# Altium schematic sheet TempRFIn.SchDoc
size A4; DrawnBy: LSR; Engineer: CW; SheetNumber: 1; SheetTotal: 1; PageSetup: Record=PageOptions|CenterHorizontal=True|CenterVertical=True|PrintScale=1.00|XCorrection=1.00|YCorrection=1.00|PrintKind=0|BorderSize=5000000|LeftOffset=0|BottomOffset=0|Orientation=2|PaperLength=1000|PaperWidth=1000|Scale=100|PaperSource=7|PrintQuality=-3|MediaType=1|DitherType=10|PrintScaleMode=1|PaperKind=A4|PaperIndex=9
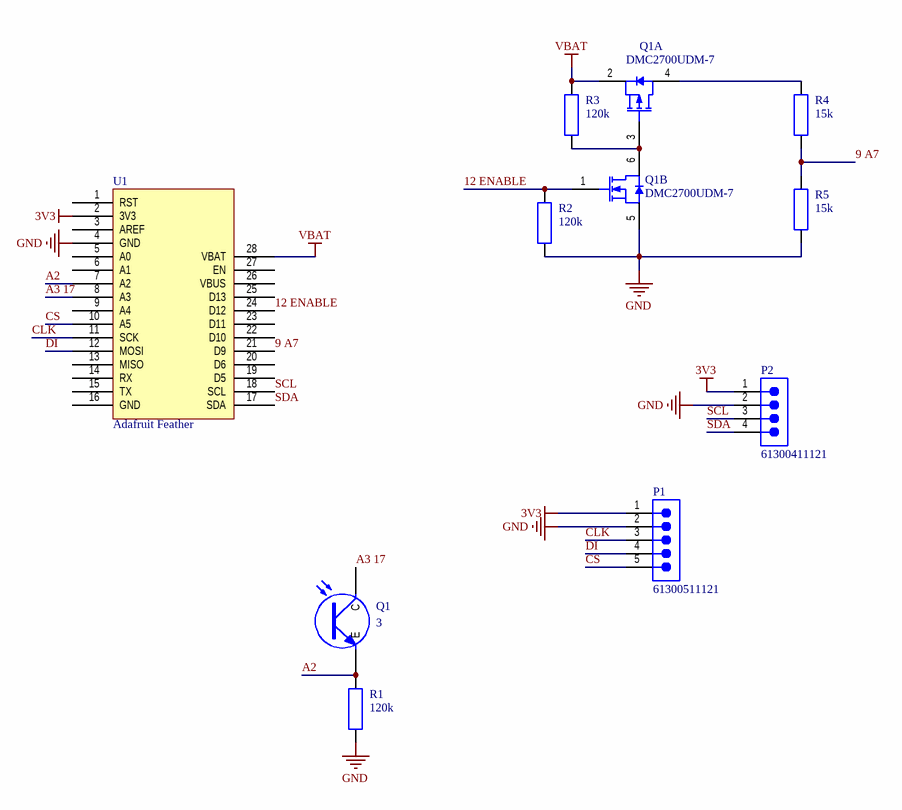
[diagram p0: TempRFIn.SchDoc]

## Parts
(Parts that share a designator on the sheet are numbered #1, #2 ... from top to bottom, then left to right.)
P1  61300511121  [61300511121]
P2  61300411121  [61300411121]
Q1#1  DMC2700UDM-7  [FAIR-SOT23-6_V]  (parts A,B of 2)
Q1#2  3  [WL-STCW_0805]
R1  120k  [0603]
R2  120k  [0603]
R3  120k  [0603]
R4  15k  [0603]
R5  15k  [0603]
U1  Adafruit Feather  [Adafruit Feather]

## Nets
3V3: P1.1 P2.1 U1.2(3V3)
GND: P1.2 P2.2 Q1#1.5(S) R1.1 R2.1 R5.1 U1.4(GND)
VBAT: Q1#1.2(S) R3.2 U1.28(VBAT)
9 A7: R4.1 R5.2 U1.21(D9)
12 ENABLE: Q1#1.1(G) R2.2 U1.24(D12)
A2: Q1#2.2(E) R1.2 U1.7(A2)
A3 17: Q1#2.1(C) U1.8(A3)
CLK: P1.3 U1.11(SCK)
CS: P1.5 U1.10(A5)
DI: P1.4 U1.12(MOSI)
SCL: P2.3 U1.18(SCL)
SDA: P2.4 U1.17(SDA)
NetQ1#1_3: Q1#1.3(G) Q1#1.6(D) R3.1
NetQ1#1_4: Q1#1.4(D) R4.2

Not connected (* = marked no-connect by the designer): U1 1(RST) 3(AREF) 5(A0) 6(A1) 9(A4) 13(MISO) 14(RX) 15(TX) 16(GND) 19(D5) 20(D6) 22(D10) 23(D11) 25(D13) 26(VBUS) 27(EN)

## Notes on the sheet
- CONFIDENTIAL
- Reference No:
- Date:
- File:
- Sheet
- Revision:
- Drawn by:
- of

## Library data of the parts
P1 = CMP-1502-01068-4: THT Vertical Pin Header WR-PHD, Pitch 2.54 mm, Single Row, 5 pins; Number of Contacts: 5; Connector Type: Male Pin; Operating Supply Voltage: 250V; Contact Resistance: 20mΩ; Gender: Male; Pitch: 2.54mm; Current Rating: 3A; Min Operating Temperature: -40°C; Contact Material: Gold; Color: Black; RoHS: Compliant; Number of Rows: 1; Lead Free: Lead Free; Height: 8.89mm; Contact Plating: Gold; Number of Pins: 5; Orientation: Vertical; Voltage Rating: 250V; Packaging: Bulk; Number of Positions: 5; Max Operating Temperature: 105°C; Termination: Solder; Lead Pitch: 2.54mm; Contact Mating Length: 5.9944mm; Mount: Through Hole
P2 = CMP-1502-01064-4: THT Vertical Pin Header WR-PHD, Pitch 2.54 mm, Single Row, 4 pins; Connector Type: Male Pin; Gender: Male; Current Rating: 3A; Number of Positions: 4; Operating Supply Voltage: 250V; Contact Resistance: 20mΩ; Pitch: 2.54mm; Max Operating Temperature: 105°C; Mount: Through Hole; Contact Material: Gold; Contact Plating: Gold; Number of Contacts: 4; Orientation: Vertical; Packaging: Bulk; Contact Mating Length: 5.9944mm; Voltage Rating: 250V; Number of Rows: 1; Height: 8.89mm; Lead Free: Lead Free; Lead Pitch: 2.54mm; Number of Pins: 4; Color: Black; Min Operating Temperature: -40°C; RoHS: Compliant; Termination: Solder
Q1#1 = CMP-2000-04939-1: Dual N & P-Channel 2.5 V Specified PowerTrench(TM) MOSFET, -55 to 150 degC, 6-Pin SOT-23, RoHS, Tape and Reel; Manufacturer: Fairchild; Typical Rise Time: 9@NChannel; Rad Hard: No; Maximum Drain Source Voltage: 20V; Typical Fall Time: 3@NChannel; Typical Turn-On Delay Time: 5@NChannel; Maximum Continuous Drain Current: 2.7@NChannel; Typical Turn-Off Delay Time: 12@NChannel; RDS-on: 80@4.5V@NChannel; Channel Mode: Enhancement; Maximum Gate Source Voltage: ±8V; Package Version: Rev. 5, 05/2015; Operating Temperature: -55to150degC; Packaging: Tape&Reel; Package Reference: SOT23-6; Package URL: https://www.fairchildsemi.com/package-drawings/MA/MA06A.pdf; Package Description: 6-Pin Small Outline Transistor, Body 2.9 x 1.6 mm, Pitch 0.95 mm; Manufacturer URL: https://www.fairchildsemi.com/; Channel Type: N; Datasheet Version: Rev. E, 07/2000; Package: 6SuperSOT; Datasheet URL: https://www.fairchildsemi.com/datasheets/FD/FDC6327C.pdf; Mounting: SurfaceMount; Category: MOSFET
Q1#2 = CMP-03913-108242142-2: Phototransistor, 940Nm, 0805 Rohs Compliant: Yes; Viewing Angle: 130°; Max Collector Current: 1mA; Width: 1.3mm; Length: 2mm; RoHS: Compliant; Max Operating Temperature: 85°C; Height: 800µm; Min Operating Temperature: -40°C
R1-R5 = R: Resistor; ComponentLink1URL: http://www.yageo.com/documents/recent/PYu-RC_Group_51_RoHS_L_7.pdf; ComponentLink1Description: http://www.yageo.com/documents/recent/PYu-RC_Group_51_RoHS_L_7.pdf